# Altium schematic sheet Pressure_Measurement.SchDoc: Vacuum chamber sensorboard - Pressure and local temperature
size A4; SheetNumber: 3; SheetTotal: 6
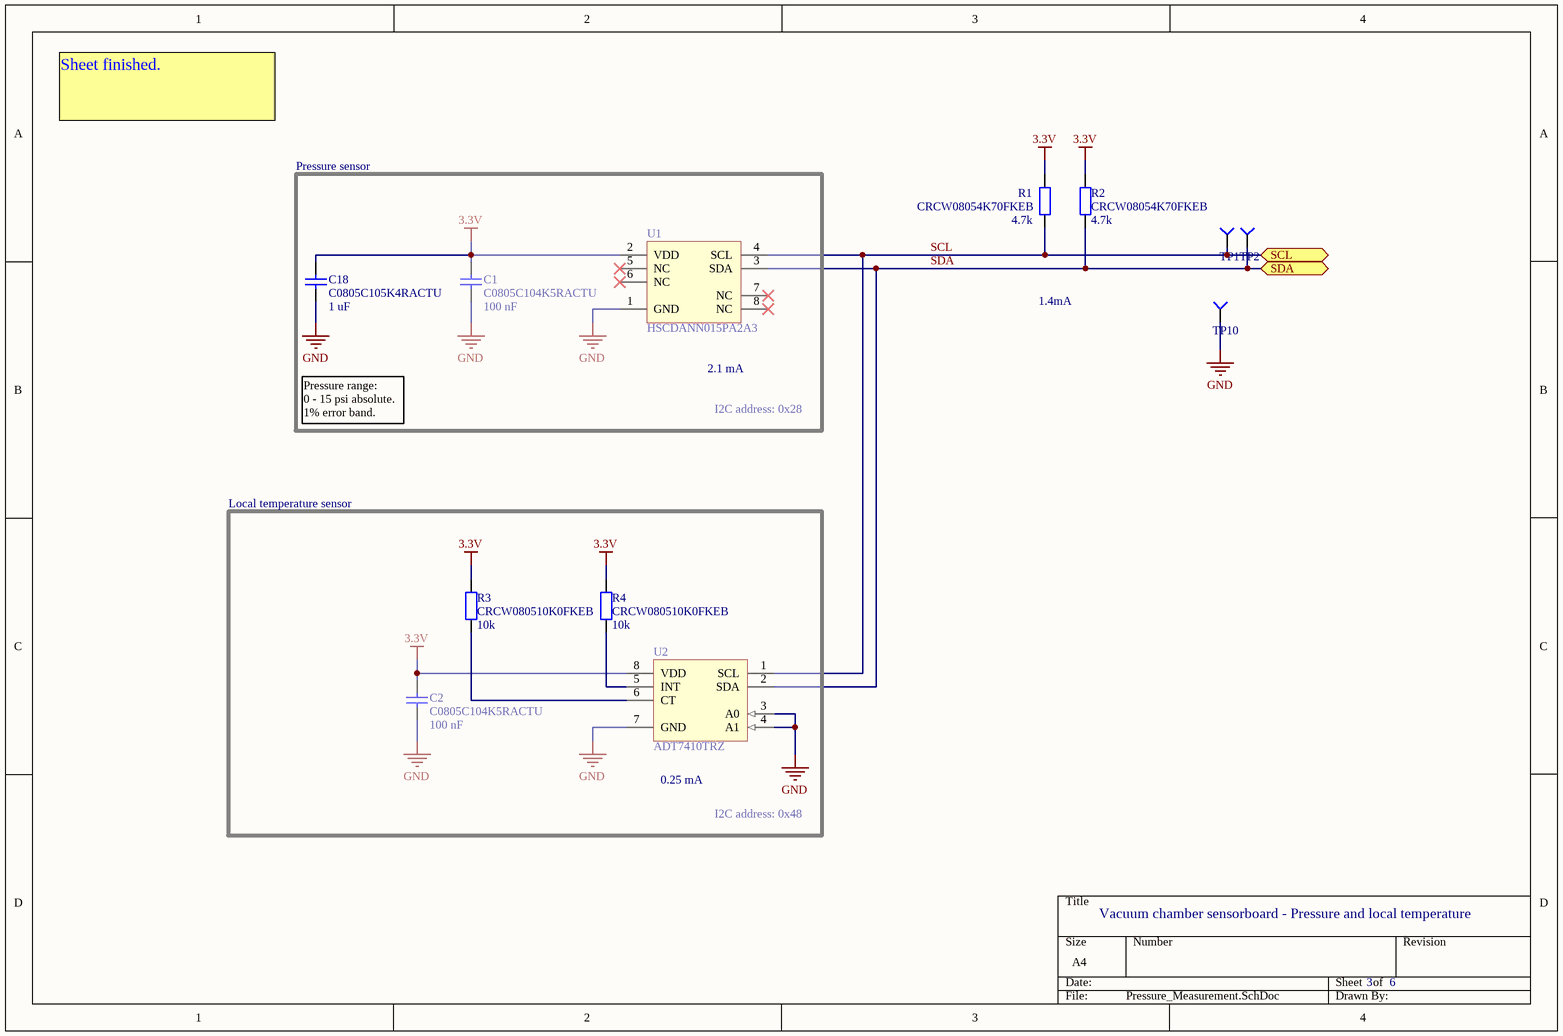
[diagram p0: Pressure_Measurement.SchDoc]

## Parts
C1  C0805C104K5RACTU  value 100 nF  [Cap Kemet 0805]
C2  C0805C104K5RACTU  value 100 nF  [Cap Kemet 0805]
C18  C0805C105K4RACTU  value 1 uF  [Cap Kemet 0805]
R1  CRCW08054K70FKEB  value 4.7k  [Res Vishay0805]
R2  CRCW08054K70FKEB  value 4.7k  [Res Vishay0805]
R3  CRCW080510K0FKEB  value 10k  [Res Vishay0805]
R4  CRCW080510K0FKEB  value 10k  [Res Vishay0805]
TP1  Test_point  [Testpoint]  (value not drawn)
TP2  Test_point  [Testpoint]  (value not drawn)
TP10  Test_point  [Testpoint]  (value not drawn)
U1  HSCDANN015PA2A3  [HSCDANN015PA2A3 Pressure sensor]
U2  ADT7410TRZ  [ADT7410]

## Ports
SCL (bidir), SDA (bidir)

## Nets
3.3V: C1.2 C2.2 C18.2 R1.2 R2.2 R3.2 R4.2 U1.2(VDD) U2.8(VDD)
GND: C1.1 C2.1 C18.1 TP10.0 U1.1(GND) U2.3(A0) U2.4(A1) U2.7(GND)
SCL: R1.1 TP1.0 U1.4(SCL) U2.1(SCL) ; port SCL
SDA: R2.1 TP2.0 U1.3(SDA) U2.2(SDA) ; port SDA
NetR3_1: R3.1 U2.6(CT)
NetR4_1: R4.1 U2.5(INT)

Not connected (* = marked no-connect by the designer): U1 5(NC)* 6(NC)* 7(NC)* 8(NC)*

## Notes on the sheet
- Sheet finished.
- Pressure sensor
- 1.4mA
- 2.1 mA
- Pressure range:
  0 - 15 psi absolute.
  1% error band.
- I2C address: 0x28
- Local temperature sensor
- (near U2) 0.25 mA
- I2C address: 0x48

## Library data of the parts
C1 C2 = C0805C104K5RACTU: Ceramic capacitor, X7R, 10%, 50V; Manufacturer: Kemet; ComponentLink1Description: Datasheet; ComponentLink1URL: http://www.kemet.com/kemet/web/homepage/kechome.nsf/vapubfiles/KEM_C1002_X7R_SMD.pdf/$file/KEM_C1002_X7R_SMD.pdf; PackageReference: 0805; Supplier 1: Mouser; Supplier Part Number 1: 80-C0805C104K5R; Supplier 2: Farnell; Supplier Part Number 2: 1414664
C18 = C0805C105K4RACTU: Ceramic capacitor, X7R, 10%, 16V; Manufacturer: Kemet; ComponentLink1Description: Datasheet; ComponentLink1URL: http://www.kemet.com/kemet/web/homepage/kechome.nsf/vapubfiles/KEM_C1002_X7R_SMD.pdf/$file/KEM_C1002_X7R_SMD.pdf; PackageReference: 0805; Supplier 1: Mouser; Supplier Part Number 1: 80-C0805C105K4R; Supplier 2: Farnell; Supplier Part Number 2: 9227792
R1 R2 = CRCW08054K70FKEB: Thick film resistor, 1%, 125mW; Manufacturer: Vishay; ComponentLink1Description: Datasheet; ComponentLink1URL: http://www.vishay.com/docs/20035/dcrcwe3.pdf; PackageReference: 0805; Supplier 1: Mouser; Supplier Part Number 1: 71-CRCW08054K70FKEB
R3 R4 = CRCW080510K0FKEB: Thick film resistor, 1%, 125mW; Manufacturer: Vishay; ComponentLink1Description: Datasheet; ComponentLink1URL: http://www.vishay.com/docs/20035/dcrcwe3.pdf; PackageReference: 0805; Supplier 1: Mouser; Supplier Part Number 1: 71-CRCW080510K0FKEB
TP1 TP2 TP10 = Test_point: pin to pad: 0>1; ComponentLink1Description: Datasheet
U1 = HSCDANN015PA2A3: Absolute pressure sensor, I2C output; PackageReference: DIP-8; ComponentLink1Description: Datasheet; ComponentLink1URL: http://sensing.honeywell.com/honeywell-sensing-hsc-high-accuracy-silicon-pressure-sensors-digital-product-sheet-008214-2-en.pdf?name=HSCMAND015PASA5; Supplier 1: Mouser; Supplier Part Number 1: 785-HSCDANN015PA2A3
U2 = ADT7410TRZ: Temperature sensor, I2C output; PackageReference: SOIC-8; ComponentLink1Description: Datasheet; ComponentLink1URL: http://www.analog.com/static/imported-files/data_sheets/ADT7410.pdf; Supplier 1: Mouser; Supplier Part Number 1: 584-ADT7410TRZ; Supplier 2: Farnell; Supplier Part Number 2: 2102534